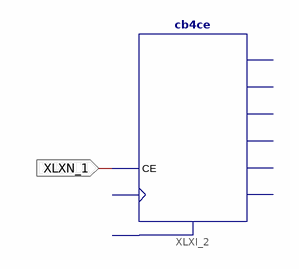
[diagram p0: schematic sheet 1]
// Xilinx ISE schematic sh.sch (artix7) as structural Verilog: 1 symbols, 1 ports
module sh (
  input  XLXN_1
);

  cb4ce XLXI_2 (.CE(XLXN_1));  // open: C, CLR, CEO, Q0, Q1, Q2, Q3, TC
endmodule
